# EasyEDA Pro project sd_reader.eprj

# Schematic Schematic1
Create Date: 2023-08-28; Page Name: P1; Project Name: sd_reader; Schematic Name: Schematic1; Update Date: 2023-09-15; Company: 嘉立创EDA; Page Size: A4; Version: V1.0
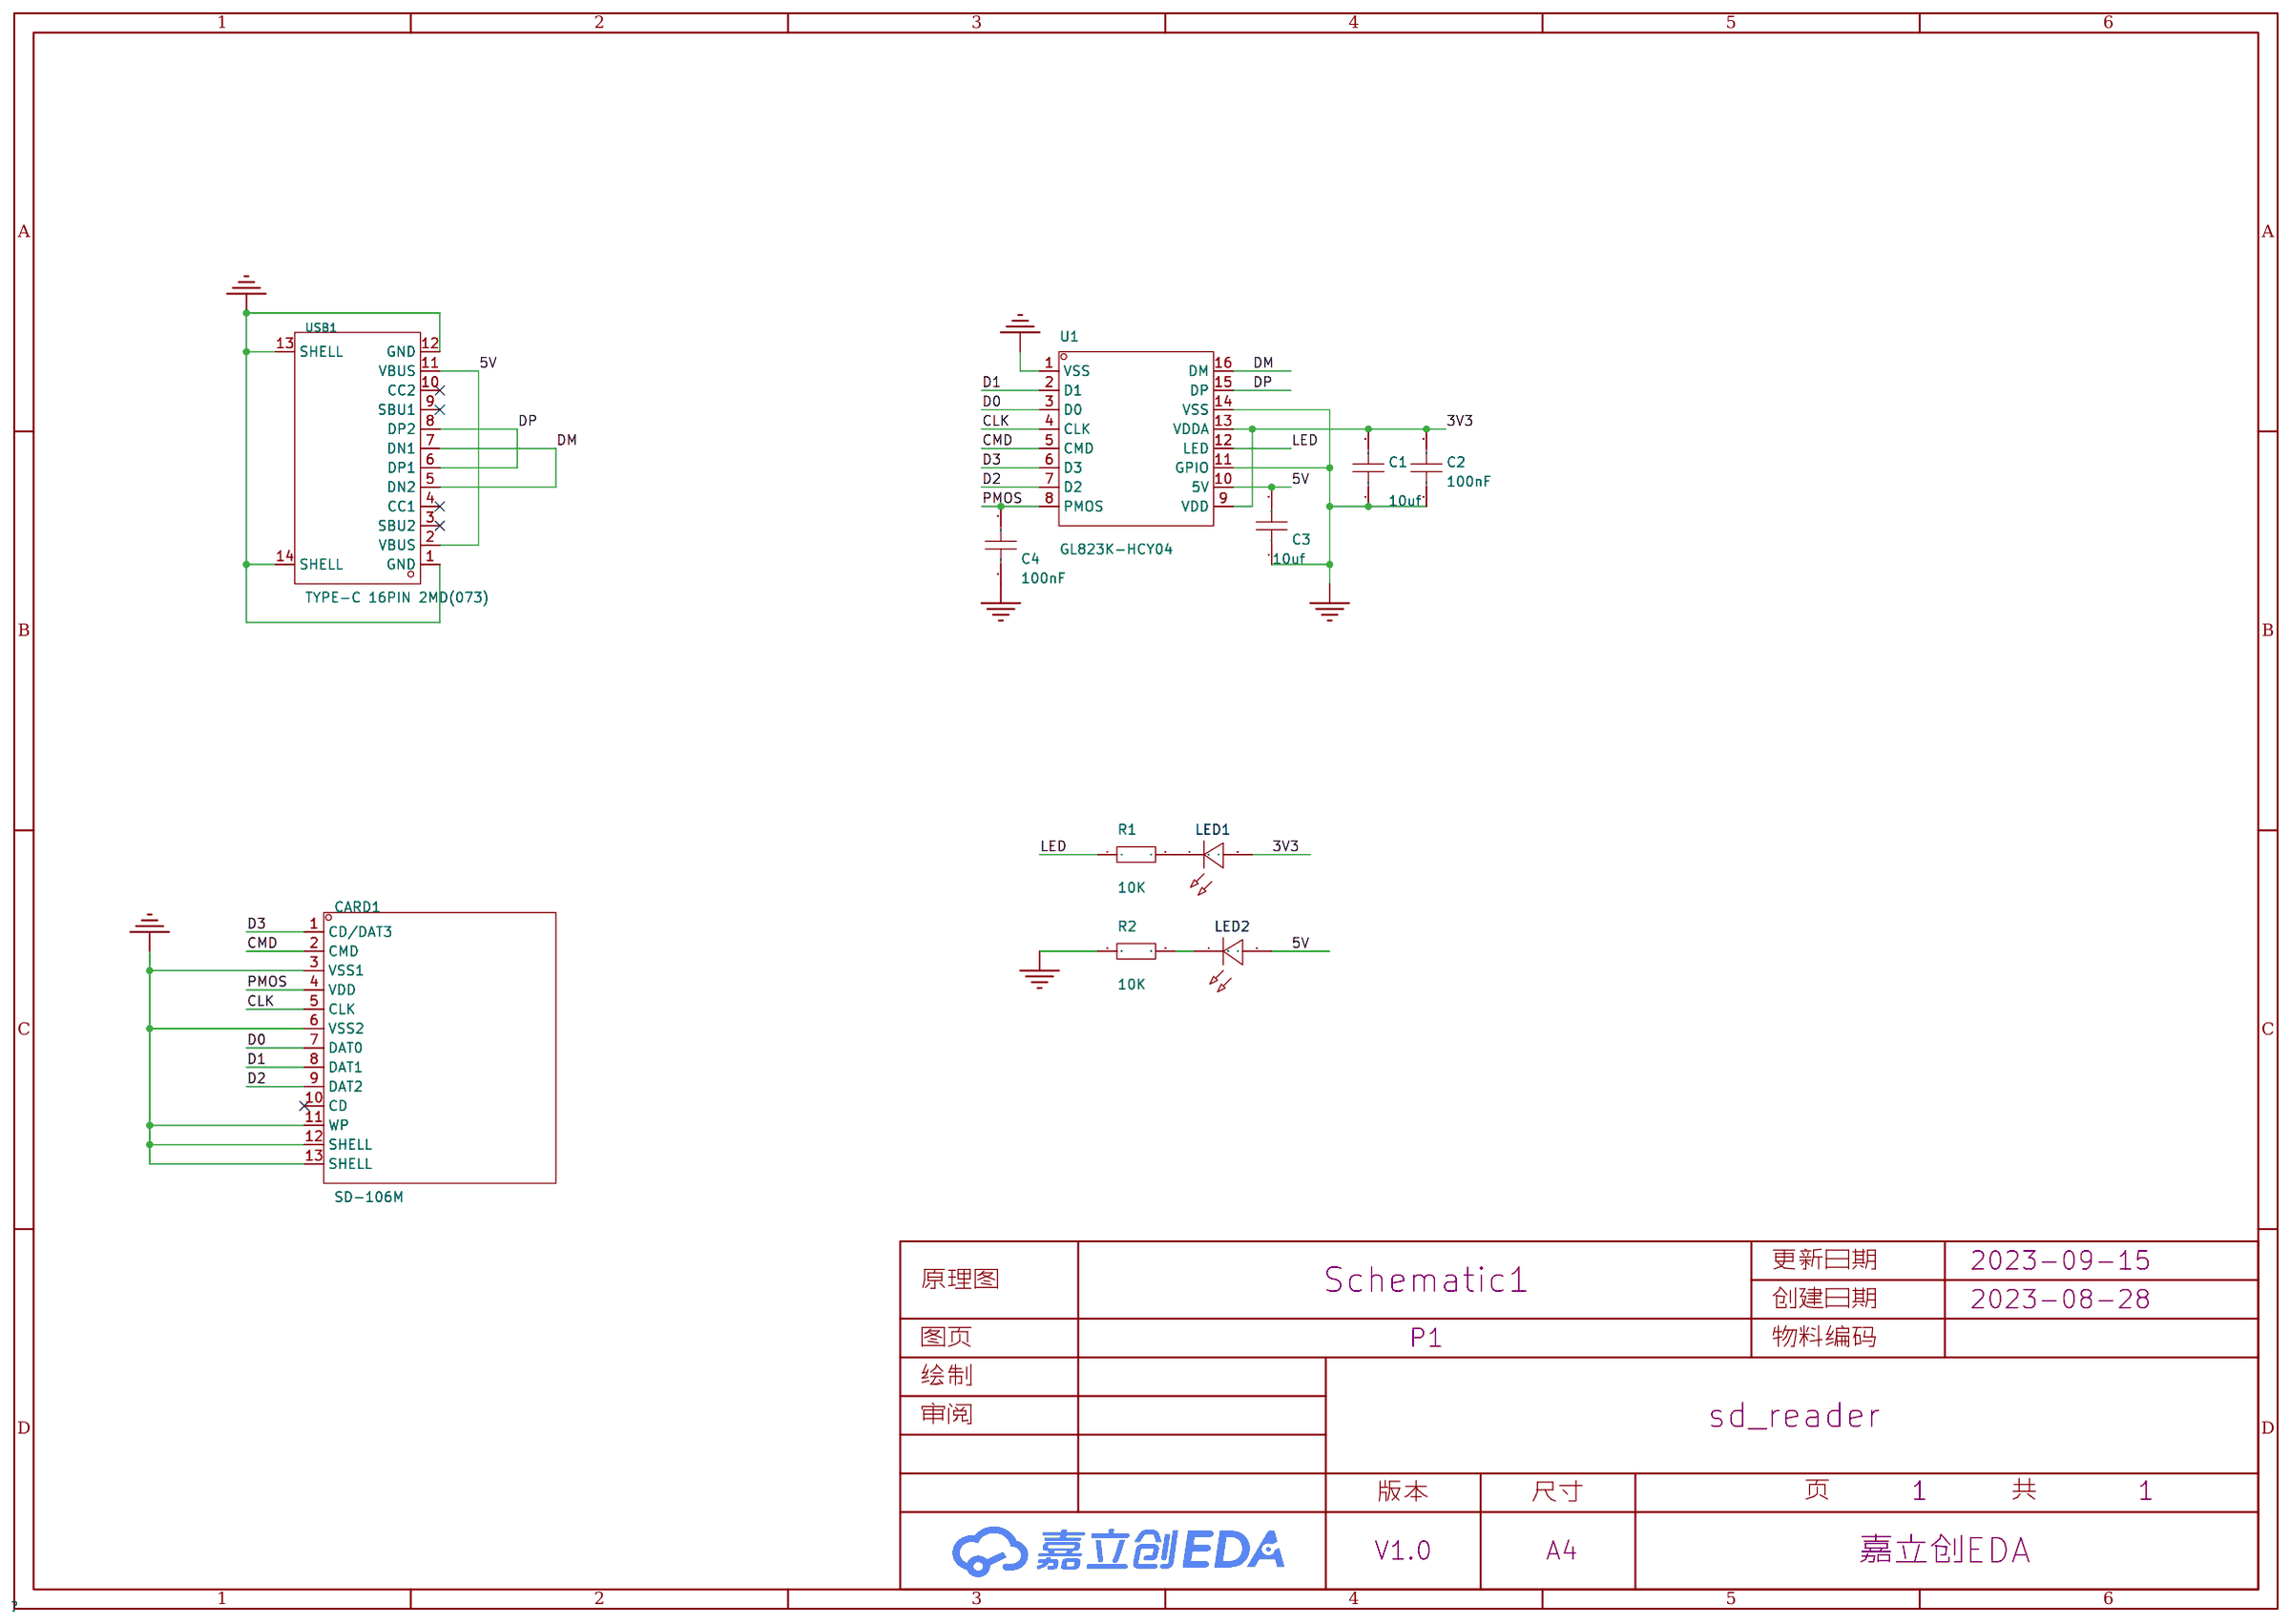
[diagram p0: schematic sheet]

## Parts
C1  10uf  [C0603]
C2  100nF  [C0603]
C3  10uf  [C0603]
C4  100nF  [C0603]
CARD1  SD-106M  [SD-SMD_SD-106M]
LED1  -  [LED_0603]
LED2  -  [LED_0603]
R1  10K  [R0603]
R2  10K  [R0603]
U1  GL823K-HCY04  [SSOP-16_L4.9-W3.9-P0.64-LS6.0-BL]
USB1  TYPE-C 16PIN 2MD(073)  [USB-C-SMD_TYPE-C-6PIN-2MD-073]

## Library data of the parts
C1-C4 = CAP_0603: Supplier Footprint: 0603
CARD1 = SD-106M: 卡连接方式:自弹式;卡类型:标准SD卡;连接器类型:卡座;本体最大高度:2.9mm;触头材质:C5191;触头镀层:金;工作温度范围:-45℃~+85℃;焊接温度(最大值):260℃;; LCSC Part Name: 自弹式 标准SD卡 卡座; Supplier Part: C266603; Manufacturer: XUNPU(讯普); Supplier Footprint: SMD; Datasheet: https://atta.szlcsc.com/upload/public/pdf/source/20210906/8CAB298B0B65163F8BCA33441A7CD5E8.pdf; Supplier: LCSC; Card Connection Mode: 自弹式; Card Type: 标准SD卡; Connector Type: 卡座; Maximum Body Height: 2.9mm; Contact Material: C5191; Contact Plating: 金; Operating Temperature Range: -45℃~+85℃; Welding Temperature (Max): 260℃
LED1 = LED_0603-B: Supplier Footprint: 0603
LED2 = LED_0603-G: Supplier Footprint: 0603
R1 R2 = Res_0603: Supplier Footprint: 0603
U1 = GL823K-HCY04: 类型:-;协议类别:-;驱动器/接收器数:-;数据速率:-;; Supplier Part: C284879; Manufacturer: GENESYS(创惟); Supplier Footprint: SSOP-16; Datasheet: https://atta.szlcsc.com/upload/public/pdf/source/20190212/C284879_D3054E8AA735401C3047DCECFFFED6D3.pdf; Supplier: LCSC
USB1 = TYPE-C 16PIN 2MD(073): 连接器类型:Type-C;标准:-;公母:母座;触点数量:16;端口数量:1;安装方式:卧贴;额定电流 - 电源:5A;工作温度范围:-25℃~+85℃;; LCSC Part Name: TYPE-C母座 16P 4脚插件带定位柱 不锈钢外壳 2次模顶; Supplier Part: C2765186; Manufacturer: SHOU HAN(首韩); Supplier Footprint: SMD; Supplier: LCSC; Connector Type: Type-C; Gender: 母座; Number of Contacts: 16; Number of Ports: 1; Mounting Style: 卧贴; Current Rating - Power (Max): 5A; Operating Temperature Range: -25℃~+85℃

## Nets
3V3: C1.2 C2.2 LED1.2(A) U1.9(VDD) U1.13(VDDA)
5V: C3.2 LED2.2(A) U1.10(5V) USB1.2(VBUS) USB1.11(VBUS)
GND: C1.1 C2.1 C3.1 C4.1 CARD1.3(VSS1) CARD1.6(VSS2) CARD1.11(WP) CARD1.12(SHELL) CARD1.13(SHELL) R2.1 U1.1(VSS) U1.11(GPIO) U1.14(VSS) USB1.1(GND) USB1.12(GND) USB1.13(SHELL) USB1.14(SHELL)
CLK: CARD1.5(CLK) U1.4(CLK)
CMD: CARD1.2(CMD) U1.5(CMD)
D0: CARD1.7(DAT0) U1.3(D0)
D1: CARD1.8(DAT1) U1.2(D1)
D2: CARD1.9(DAT2) U1.7(D2)
D3: CARD1.1(CD/DAT3) U1.6(D3)
DM: U1.16(DM) USB1.5(DN2) USB1.7(DN1)
DP: U1.15(DP) USB1.6(DP1) USB1.8(DP2)
LED: R1.1 U1.12(LED)
PMOS: C4.2 CARD1.4(VDD) U1.8(PMOS)
$1N7957: LED2.1(C) R2.2
$1N8019: LED1.1(C) R1.2

Not connected (* = marked no-connect by the designer): CARD1 10(CD)*; USB1 3(SBU2)* 4(CC1)* 9(SBU1)* 10(CC2)*

# Board PCB1
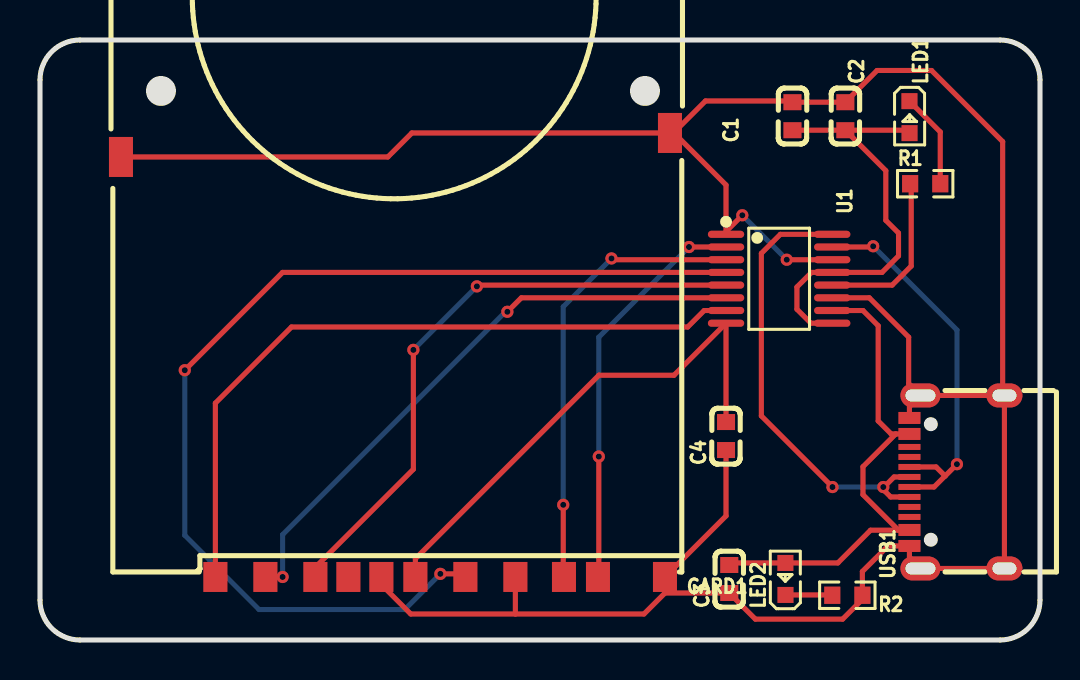
[diagram p1: board, top side]
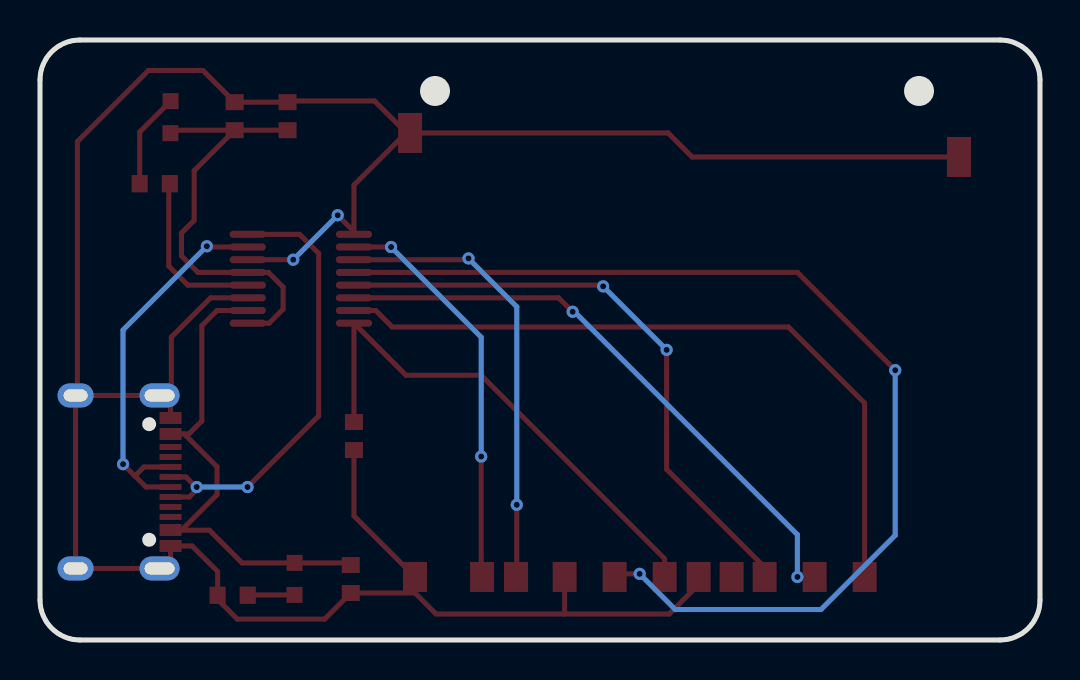
[diagram p2: board, bottom side, seen from below]

Outline 50 x 30 mm; copper layers: Top Layer, Bottom Layer. Coordinates in mm from the lower left corner of the outline.
Outline path: 0,28 0,2 arc(0.59,0.59) 2,0 48,0 arc(49.41,0.59) 50,2 50,28 arc(49.41,29.41) 48,30 2,30 arc(0.59,29.41) 0,28
Stack: Top Layer 0.035mm - / Dielectric1 1.51mm FR4 er 4.5 / Bottom Layer 0.035mm -

## Design rules (mm)
template: JLCPCB Capability(Two Layers Board)
spacing copperThickness1oz (default): track to track 0.102, other pairs 0.152 to 0.3
spacing copperThickness2oz: track to track 0.203, other pairs 0.152 to 0.3
track width copperThickness1oz (default): min 0.127, default 0.254, max 2.54
track width copperThickness2oz: min 0.203, default 0.254, max 2.54
differential pair differentialPair (default): width min 0.127, default 0.254, max 2.54; gap min 0.152, default 0.152
via viaSize (default): diameter min 0.5, default 0.61, max 10; hole min 0.3, default 0.305, max 6.3

## Placement (name value [footprint] x y rotation side)
C1  10uf  [C0603]  37.62 26.19 270 top
C2  100nF  [C0603]  40.27 26.19 270 top
C3  10uf  [C0603]  34.46 3.05 90 top
C4  100nF  [C0603]  34.3 10.2 90 top
CARD1  SD-106M  [SD-SMD_SD-106M]  17.77 14.25 180 top
LED1  -  [LED_0603]  43.48 26.09 270 top
LED2  -  [LED_0603]  37.26 3.1 90 top
R1  10K  [R0603]  44.26 22.81 0 top
R2  10K  [R0603]  40.37 2.24 180 top
U1  GL823K-HCY04  [SSOP-16_L4.9-W3.9-P0.64-LS6.0-BL]  36.96 18.06 270 top
USB1  TYPE-C 16PIN 2MD(073)  [USB-C-SMD_TYPE-C-6PIN-2MD-073]  45.85 7.9 90 top

## Footprints (pads in the part's own frame, mm; a bottom-side part is the same pattern mirrored in y, then rotated)
C0603
  rect 0.8x0.9 smd: 1(-0.7,0) 2(0.7,0)
LED_0603
  rect 0.8x0.8 smd: 1(-0.851,-0.01) 2(0.75,-0.005)
R0603
  rect 0.806x0.864 smd: 1(-0.753,0) 2(0.753,0)
SD-SMD_SD-106M
  rect 1.2x1.5 smd: 1(6.505,11.1) 2(4.005,11.1) 3(0.705,11.1) 4(-0.995,11.1) 5(-3.495,11.1) 6(-5.995,11.1) 7(-8.425,11.1) 8(-10.125,11.1) 9(9.005,11.1) 10(2.355,11.1) 11(-13.475,11.1)
  rect 1.2x2 smd: 12(-13.725,-11.1) 13(13.725,-9.9)
SSOP-16_L4.9-W3.9-P0.64-LS6.0-BL
  oval 0.355x1.815 smd: 1(-2.223,-2.655) 2(-1.587,-2.655) 3(-0.953,-2.655) 4(-0.318,-2.655) 5(0.318,-2.655) 6(0.953,-2.655) 7(1.587,-2.655) 8(2.223,-2.655) 9(2.223,2.655) 10(1.587,2.655) 11(0.953,2.655) 12(0.318,2.655) 13(-0.318,2.655) 14(-0.953,2.655) 15(-1.587,2.655) 16(-2.223,2.655)
USB-C-SMD_TYPE-C-6PIN-2MD-073
  rect 0.6x1.1 smd: 1(-3.2,2.375) 2(-2.4,2.375) 11(2.4,2.375) 12(3.2,2.375)
  rect 0.3x1.1 smd: 3(-1.75,2.375) 4(-1.25,2.375) 5(-0.75,2.375) 6(-0.25,2.375) 7(0.25,2.375) 8(0.75,2.375) 9(1.25,2.375) 10(1.75,2.375)
  oval 1.2x2 hole 0.6x1.5: 13(-4.325,1.825) 14(4.325,1.825)
  oval 1.2x1.8 hole 0.6x1.2: 13(-4.325,-2.375) 14(4.325,-2.375)

## Nets
As in the schematic.

Pads without a net: CARD1 10; USB1 3 4 9 10

## Via types
v1: diameter 0.61, hole 0.305, Top Layer to Bottom Layer, 16 vias

## Routing (per net, layer and track width the routed paths; a pad name or vN(x,y) marks a point on that pad's centre or on a via; arc(x,y) is an arc through that point)
3V3: length 22.2
  Top Layer w0.254: C2.2 43.33,25.49 LED1.2 ; C2.2 42.29,23.47 42.29,20.98 42.93,20.35 42.93,19.2 42.1,18.38 U1.13 38.58,18.38 37.85,17.65 37.85,16.54 38.54,15.84 U1.9 ; C2.2 C1.2
5V: length 25.8
  Top Layer w0.254: USB1.11 42.79,10.3 ; 42.79,10.3 42.56,10.3 41.91,10.95 41.91,15.71 41.15,16.47 U1.10 ; 42.79,10.3 41.15,8.66 41.15,7.27 42.91,5.5 USB1.2 43.46,5.49 41.53,5.49 39.89,3.85 LED2.2 34.46,3.85 C3.2
GND: length 141.4
  Top Layer w0.254: U1.14 v1(37.34,19.01) ; USB1.14 43.43,12.81 43.43,15.14 41.47,17.11 U1.11 ; USB1.14 43.47,11.68 USB1.12 ; USB1.14 USB1.14 ; C4.1 34.3,6.21 CARD1.11 31.25,2.35 ; 31.25,2.35 C3.1 35.77,1.04 40.13,1.04 41.12,2.03 R2.1 41.12,3.42 42.4,4.7 USB1.1 43.47,4.13 USB1.13 USB1.13 USB1.14 ; 31.25,2.35 30.2,1.3 23.77,1.3 ; CARD1.13 17.39,24.15 18.59,25.35 CARD1.12 31.7,25.35 ; USB1.14 48.13,12.32 48.13,24.92 44.58,28.48 41.85,28.48 C2.1 C1.1 37.56,26.95 33.27,26.95 31.7,25.38 31.7,25.35 ; 34.3,20.42 U1.1 ; 34.3,20.42 v1(35.12,21.24) ; 34.3,20.42 34.3,22.75 31.7,25.35 ; 23.77,1.3 CARD1.6 ; 23.77,1.3 18.54,1.3 17.07,2.77 CARD1.3
  Bottom Layer w0.254: 35.05,21.24 v1(35.12,21.24) v1(37.34,19.01)
CLK: length 53.7
  Top Layer w0.254: CARD1.5 21.11,3.31 v1(20.02,3.31) ; v1(7.24,13.49) 12.13,18.38 U1.4
  Bottom Layer w0.254: v1(20.02,3.31) 18.23,1.52 10.95,1.52 7.24,5.23 v1(7.24,13.49)
CMD: length 30.4
  Top Layer w0.254: v1(21.84,17.68) 21.91,17.74 U1.5 ; v1(18.67,14.51) 18.67,8.54 13.77,3.64 CARD1.2
  Bottom Layer w0.254: v1(18.67,14.51) v1(21.84,17.68)
D0: length 22.7
  Top Layer w0.254: CARD1.7 26.16,3.19 v1(26.16,6.76) ; v1(28.57,19.08) 28.64,19.01 U1.3
  Bottom Layer w0.254: v1(26.16,6.76) 26.16,16.67 v1(28.57,19.08)
D1: length 20.2
  Top Layer w0.254: v1(27.94,9.17) 27.94,3.19 CARD1.8 ; U1.2 v1(32.45,19.65)
  Bottom Layer w0.254: v1(32.45,19.65) 27.94,15.14 v1(27.94,9.17)
D2: length 36.1
  Top Layer w0.254: U1.7 33.21,16.47 32.38,15.65 12.57,15.65 8.77,11.84 CARD1.9
D3: length 30.1
  Top Layer w0.254: v1(23.37,16.41) 24.07,17.11 U1.6 ; v1(12.13,3.15) CARD1.1
  Bottom Layer w0.254: v1(12.13,3.15) 12.13,5.27 23.27,16.41 v1(23.37,16.41)
DM: length 22.9
  Top Layer w0.254: v1(42.16,7.65) 42.16,7.52 42.22,7.46 ; 42.22,7.46 42.22,7.67 42.7,8.15 USB1.7 ; 42.22,7.46 42.53,7.15 USB1.5 ; U1.16 37.02,20.28 36.07,19.33 36.07,11.2 v1(39.62,7.65)
  Bottom Layer w0.254: v1(39.62,7.65) v1(42.16,7.65)
DP: length 19.5
  Top Layer w0.254: USB1.8 44.8,8.65 45.25,8.2 ; U1.15 41.62,19.65 v1(41.66,19.69) ; USB1.6 44.7,7.65 45.25,8.2 ; v1(45.85,8.79) 45.26,8.2 45.25,8.2
  Bottom Layer w0.254: v1(41.66,19.69) 45.85,15.5 v1(45.85,8.79)
LED: length 8.5
  Top Layer w0.254: U1.12 42.61,17.74 43.56,18.7 43.56,22.76 R1.1
PMOS: length 26.3
  Top Layer w0.254: C4.2 U1.8 31.7,13.24 27.94,13.24 18.77,4.06 CARD1.4
$1N7957: length 2.3
  Top Layer w0.254: LED2.1 39.6,2.25 R2.2
$1N8019: length 4.8
  Top Layer w0.254: R1.2 45.01,25.4 LED1.1

## Copper pours and planes (outline as drawn; the poured copper is in the pictures)
GND on Top Layer: -12.7,40.67 56.51,40.67 56.51,-7.34 -12.7,-7.34
GND on Bottom Layer: -12.57,40.54 56.39,40.54 56.39,-7.21 -12.57,-7.21
